# Altium project PprzSDLogger.PrjPcb
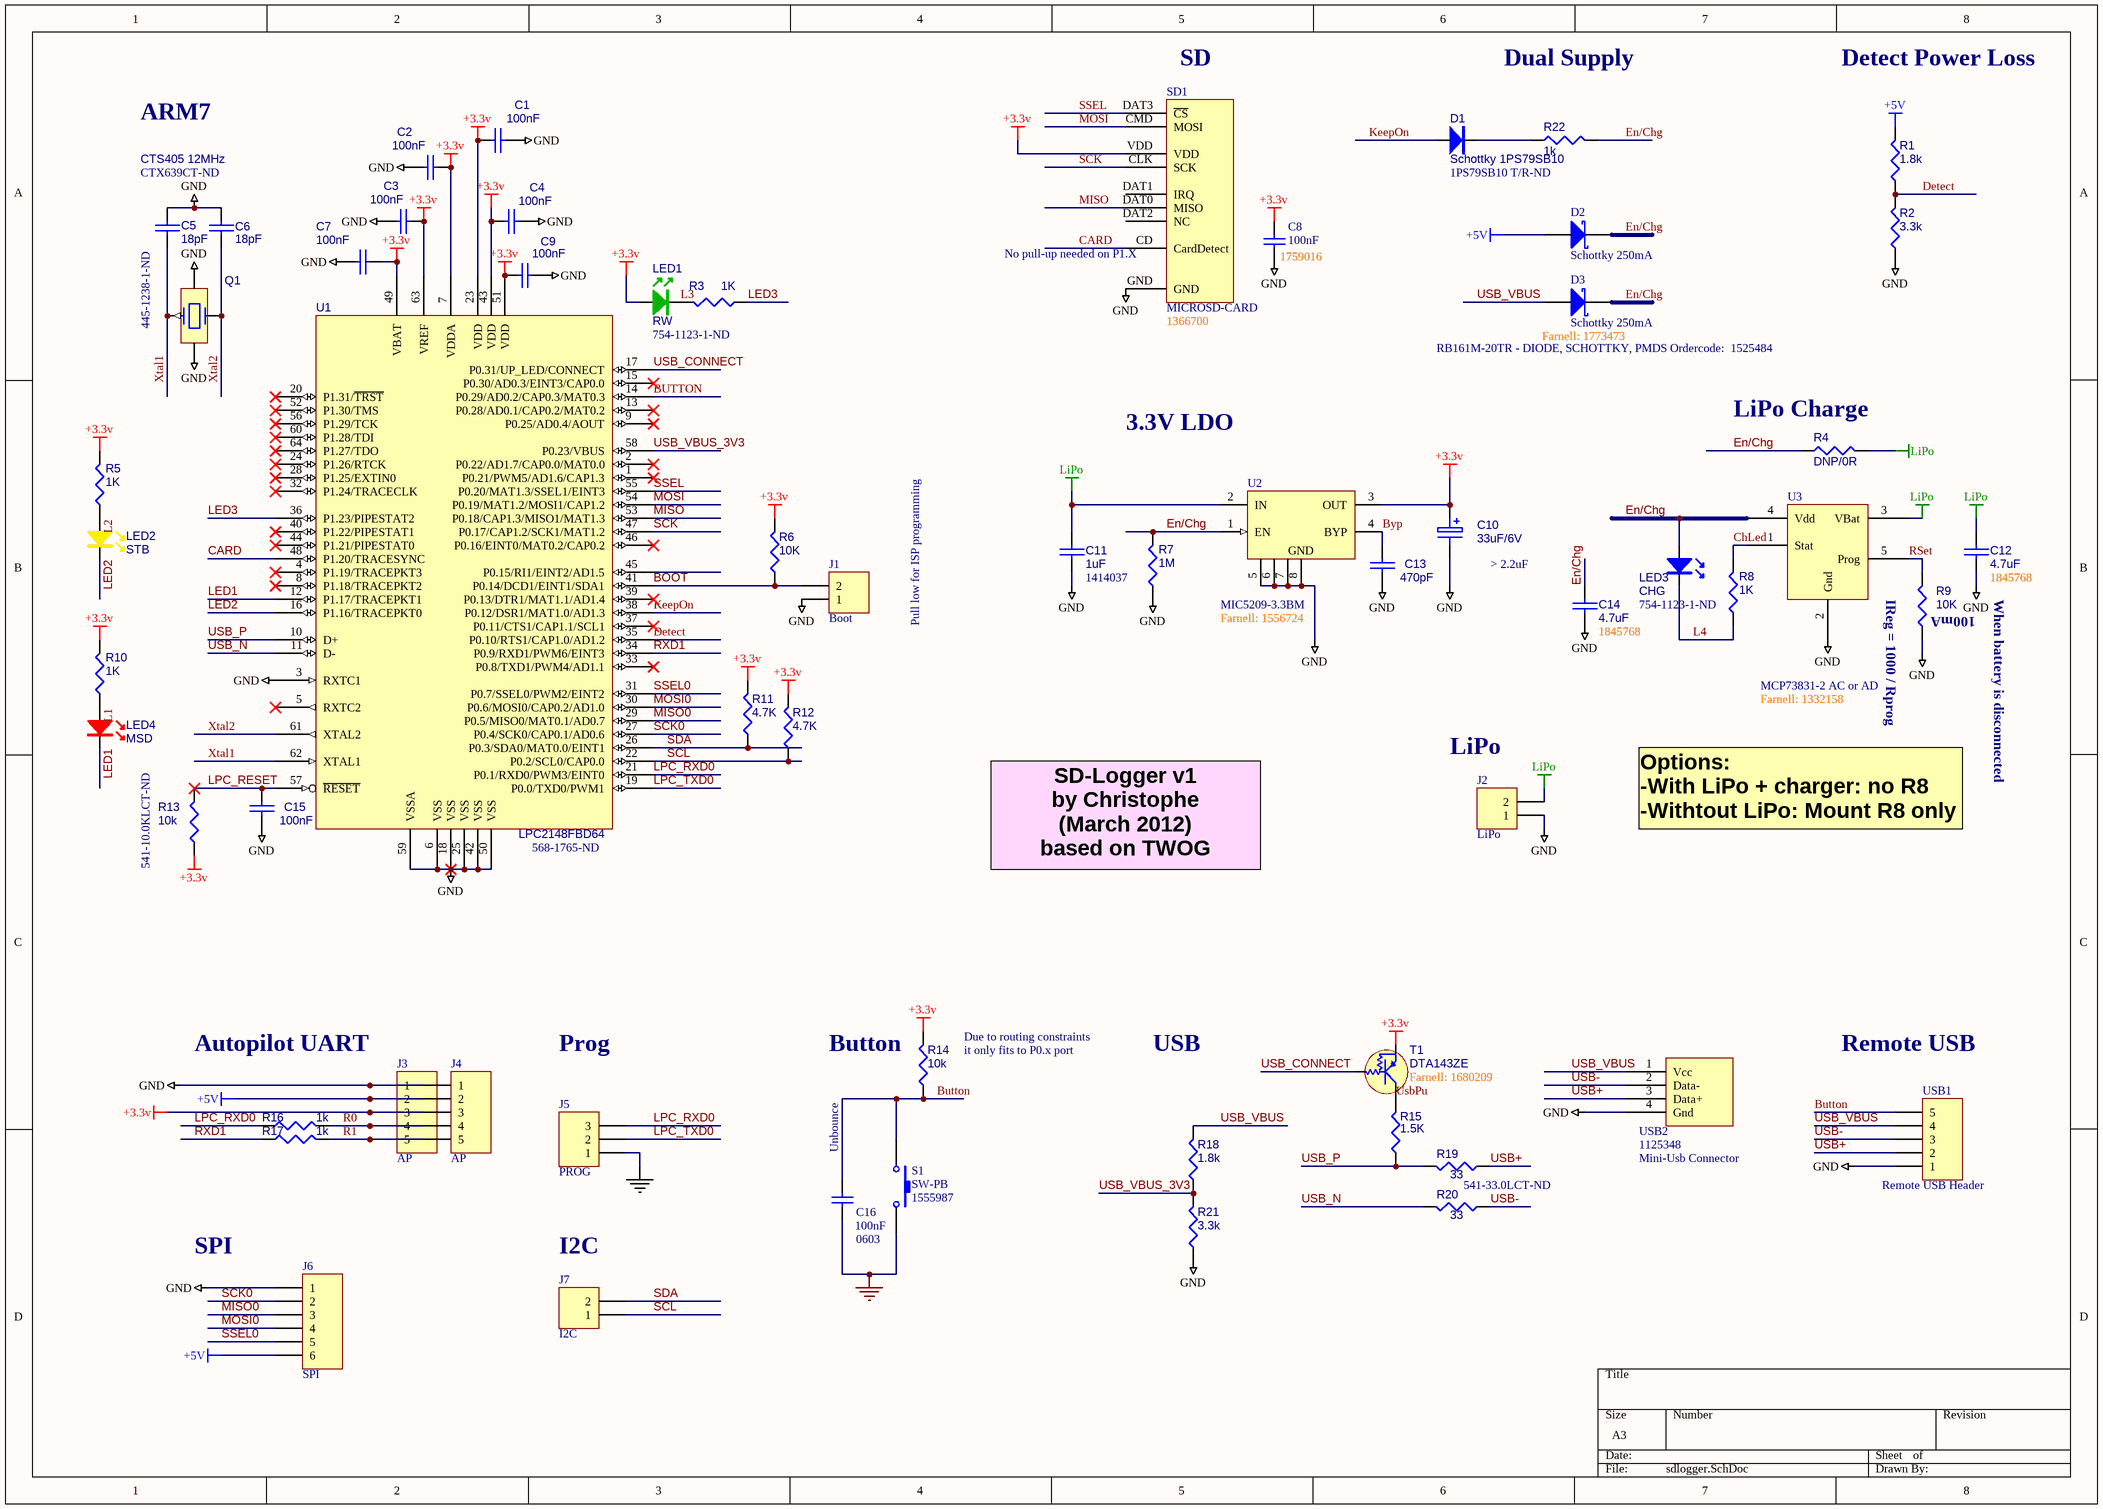
[diagram p0: sdlogger.SchDoc]
1 sheet, 61 parts. Net scope: global (net labels, ports and power ports of the same name join across sheets).
Board file: sdlogger.PcbDoc

## Sheet sdlogger.SchDoc
size A3; PageSetup: Record=PageOptions|CenterHorizontal=True|CenterVertical=True|PrintScale=1.00|XCorrection=1.00|YCorrection=1.00|PrintKind=0|BorderSize=5000000|LeftOffset=0|BottomOffset=0|Orientation=2|PaperLength=1000|PaperWidth=1000|Scale=100|PaperSource=7|PrintQuality=-4|MediaType=1|DitherType=10|PaperKind=A4|PrintScaleMode=1

### Parts
C1  100nF  [0603]
C2  100nF  [0603]
C3  100nF  [0603]
C4  100nF  [0603]
C5  18pF  Supplier Part Number 1: 445-1238-1-ND  [0603]
C6  18pF  [0603]
C7  100nF  [0603]
C8  value 100nF  Farnell: 1759016  [0603]  (hidden comment: 0603)
C9  100nF  [0603]
C10  33uF/6V  [T491A]
C11  1uF  farnell: 1414037  [0805]
C12  4.7uF  farnell: 1845768  [0805]
C13  470pF  [0603]
C14  4.7uF  farnell: 1845768  [0805]
C15  100nF  [0603]
C16  0603  value 100nF  [0603]
D1  Schottky 1PS79SB10  Supplier Part Number 1: 1PS79SB10 T/R-ND  [1PS79SB10]
D2  Schottky 250mA  [SOD123]
D3  Schottky 250mA  Farnell: 1773473  [SOD123]
J1  Boot  [2pin1mmpitch]
J2  LiPo  [PICOBLADE_53047-0210]
J3  AP  [PICOBLADE_53047-0510_FLAT]
J4  AP  [PICOBLADE_53047-0510_FLAT]
J5  PROG  [PICOBLADE_53047-0310]
J6  SPI  [PICOBLADE_53047-0610]
J7  I2C  [PICOBLADE_53047-0210]
LED1  RW  Supplier Part Number 1: 754-1123-1-ND  [KP-1608SURC]
LED2  STB  [KP-1608SURC]
LED3  CHG  Supplier Part Number 1: 754-1123-1-ND  [KP-1608SURC]
LED4  MSD  [KP-1608SURC]
Q1  CTS405 12MHz  Supplier Part Number 1: CTX639CT-ND  [CTS_405]
R1  1.8k  [0603RES]
R2  3.3k  [0603RES]
R3  1K  [0603RES]
R4  DNP/0R  [0603RES]
R5  1K  [0603RES]
R6  10K  [0603RES]
R7  1M  [0603RES]
R8  1K  [0603RES]
R9  10K  [0603RES]
R10  1K  [0603RES]
R11  4.7K  [0603RES]
R12  4.7K  [0603RES]
R13  10k  Supplier Part Number 1: 541-10.0KLCT-ND  [0603RES]
R14  10k  [0603RES]
R15  1.5K  [0603RES]
R16  1k  [0603RES]
R17  1k  [0603RES]
R18  1.8k  [0603RES]
R19  33  Supplier Part Number 1: 541-33.0LCT-ND  [0603RES]
R20  33  [0603RES]
R21  3.3k  [0603RES]
R22  1k  [0603RES]
S1  SW-PB  Farnell: 1555987  [FSMRA2JH]
SD1  MICROSD-CARD  Farnell: 1366700  [MICROSD-card]
T1  DTA143ZE  Farnell: 1680209  [DTA143ZE]
U1  LPC2148FBD64  Supplier Part Number 1: 568-1765-ND  [LPC2148FBD64]
U2  value MIC5209-3.3BM  Farnell: 1556724  [SO8]  (hidden comment: MIC5209-3.3YM)
U3  Farnell: 1332158  [SOT23-5]  (hidden comment: MCP73831-2 AC or AD)
USB1  Remote USB Header  [PICOBLADE_53047-0510_FLAT_ONLY]
USB2  Mini-Usb Connector  Farnell: 1125348  [miniUSB]

### Nets
+3.3v: C1.1 C2.2 C3.2 C4.1 C7.2 C8.1 C9.2 C10.1 J3.3 J4.3 LED1.1(A) R5.2 R6.2 R10.2 R11.2 R12.2 R13.1 R14.2 SD1.VDD T1.2 U1.7(VDDA) U1.23(VDD) U1.43(VDD) U1.49(VBAT) U1.51(VDD) U1.63(VREF) U2.3(OUT)
+5V: D2.1(A) J3.2 J4.2 J6.6 R1.2
GND: C1.2 C2.1 C3.1 C4.2 C5.1 C6.1 C7.1 C8.2 C9.1 C10.2 C11.2 C12.2 C13.2 C14.2 C15.2 C16.1 J1.1 J2.1 J3.1 J4.1 J5.1 J6.1 Q1.2 Q1.4 R2.1 R7.1 R9.1 R21.1 S1.2 SD1.GND U1.3(RXTC1) U1.6(VSS) U1.18(VSS) U1.25(VSS) U1.42(VSS) U1.50(VSS) U1.59(VSSA) U2.5(GND) U2.6(GND) U2.7(GND) U2.8(GND) U3.2(Gnd) USB1.1 USB2.4(Gnd)
LiPo: C11.1 C12.1 J2.2 R4.2 U2.2(IN) U3.3(VBat)
BOOT: J1.2 R6.1 U1.41(P0.14/DCD1/EINT1/SDA1)
Button: C16.2 R14.1 S1.1 U1.14(P0.29/AD0.2/CAP0.3/MAT0.3) USB1.5
Byp: C13.1 U2.4(BYP)
CARD: SD1.CD(CardDetect) U1.48(P1.20/TRACESYNC)
ChLed: R8.2 U3.1(Stat)
Detect: R1.1 R2.2 U1.35(P0.10/RTS1/CAP1.0/AD1.2)
En/Chg: C14.1 D2.2(K) D3.2(K) LED3.1(A) R4.1 R7.2 R22.2 U2.1(EN) U3.4(Vdd)
KeepOn: D1.2(A) U1.38(P0.12/DSR1/MAT1.0/AD1.3)
L1: LED4.1(A) R10.1
L2: LED2.1(A) R5.1
L3: LED1.2(K) R3.2
L4: LED3.2(K) R8.1
LED1: LED4.2(K) U1.12(P1.17/TRACEPKT1)
LED2: LED2.2(K) U1.16(P1.16/TRACEPKT0)
LED3: R3.1 U1.36(P1.23/PIPESTAT2)
LPC_RESET: C15.1 R13.2 U1.57(~{RESET})
LPC_RXD0: J5.3 R16.1 U1.21(P0.1/RXD0/PWM3/EINT0)
LPC_TXD0: J5.2 U1.19(P0.0/TXD0/PWM1)
MISO: SD1.DAT0(MISO) U1.53(P0.18/CAP1.3/MISO1/MAT1.3)
MISO0: J6.3 U1.29(P0.5/MISO0/MAT0.1/AD0.7)
MOSI: SD1.CMD(MOSI) U1.54(P0.19/MAT1.2/MOSI1/CAP1.2)
MOSI0: J6.4 U1.30(P0.6/MOSI0/CAP0.2/AD1.0)
R0: J3.4 J4.4 R16.2
R1: J3.5 J4.5 R17.2
RSet: R9.2 U3.5(Prog)
RXD1: R17.1 U1.34(P0.9/RXD1/PWM6/EINT3)
SCK: SD1.CLK(SCK) U1.47(P0.17/CAP1.2/SCK1/MAT1.2)
SCK0: J6.2 U1.27(P0.4/SCK0/CAP0.1/AD0.6)
SCL: J7.1 R12.1 U1.22(P0.2/SCL0/CAP0.0)
SDA: J7.2 R11.1 U1.26(P0.3/SDA0/MAT0.0/EINT1)
SSEL: SD1.DAT3(~{CS}) U1.55(P0.20/MAT1.3/SSEL1/EINT3)
SSEL0: J6.5 U1.31(P0.7/SSEL0/PWM2/EINT2)
USB+: R19.1 USB1.2 USB2.3(Data+)
USB-: R20.1 USB1.3 USB2.2(Data-)
USB_CONNECT: T1.1 U1.17(P0.31/UP_LED/CONNECT)
USB_N: R20.2 U1.11(D-)
USB_P: R15.1 R19.2 U1.10(D+)
USB_VBUS: D3.1(A) R18.2 USB1.4 USB2.1(Vcc)
USB_VBUS_3V3: R18.1 R21.2 U1.58(P0.23/VBUS)
UsbPu: R15.2 T1.3
Xtal1: C5.2 Q1.1 U1.62(XTAL1)
Xtal2: C6.2 Q1.3 U1.61(XTAL2)
NetD1_1: D1.1(K) R22.1

Not connected (* = marked no-connect by the designer): SD1 DAT1(IRQ) DAT2(NC); U1 1(P0.21/PWM5/AD1.6/CAP1.3)* 2(P0.22/AD1.7/CAP0.0/MAT0.0)* 4(P1.19/TRACEPKT3)* 5(RXTC2)* 8(P1.18/TRACEPKT2)* 9(P0.25/AD0.4/AOUT)* 13(P0.28/AD0.1/CAP0.2/MAT0.2)* 15(P0.30/AD0.3/EINT3/CAP0.0)* 20(P1.31/~{TRST})* 24(P1.26/RTCK)* 28(P1.25/EXTIN0)* 32(P1.24/TRACECLK)* 33(P0.8/TXD1/PWM4/AD1.1)* 37(P0.11/CTS1/CAP1.1/SCL1)* 39(P0.13/DTR1/MAT1.1/AD1.4)* 40(P1.22/PIPESTAT1)* 44(P1.21/PIPESTAT0)* 45(P0.15/RI1/EINT2/AD1.5) 46(P0.16/EINT0/MAT0.2/CAP0.2)* 52(P1.30/TMS)* 56(P1.29/TCK)* 60(P1.28/TDI)* 64(P1.27/TDO)*

### Notes on the sheet
- (near SD1) SD
- Dual Supply
- Detect Power Loss
- ARM7
- (near SD1) No pull-up needed on P1.X
- (near D3) RB161M-20TR - DIODE, SCHOTTKY, PMDS Ordercode:  1525484
- 3.3V LDO
- (near R4) LiPo Charge
- > 2.2uF
- Pull low for ISP programming
- IReg = 1000 / Rprog
- (near R9) 100mA
- When battery is disconnected
- (near J2) LiPo
- Options:
  -With LiPo + charger: no R8
  -Withtout LiPo: Mount R8 only
- SD-Logger v1
  by Christophe
  (March 2012)
  based on TWOG
- (near J3) Autopilot UART
- Prog
- (near R14) Button
- (near R14) Due to routing constraints
- (near R14) it only fits to P0.x port
- USB
- Remote USB
- Unbounce
- SPI
- (near J7) I2C

### Library data of the parts
C1-C7 C9 C11-C15 = CAP
  C5: Supplier 1: Digi-Key
C8 = Cap: Capacitor; ps: 1000; Note: 0603, X7R, 16V, 100NF; Revision: July-2002: Re-released for DXP Platform.; Price: 0.005
C10 = ELECTRO1
C16 = Cap: Capacitor; Published: 8-Jun-2000; Revision: July-2002: Re-released for DXP Platform.; Publisher: Altium Limited
D1 = 1PS79SB10: Diode Schottky 0.2A/30v (GRZ 09/2007); Supplier 1: Digi-Key
D2 D3 = D Schottky: Schottky Diode; Published: 8-Jun-2000; LatestRevisionDate: 17-Jul-2002; LatestRevisionNote: Re-released for DXP Platform.; PackageReference: SMB; Publisher: Altium Limited; Code_JEDEC: DO-214-AA
J1 J2 J7 = Header 2: Header, 2-Pin; LatestRevisionDate: 17-Jul-2002; LatestRevisionNote: Re-released for DXP Platform.; Publisher: Altium Limited
J3 J4 USB1 = Header 5: Header, 5-Pin; LatestRevisionDate: 17-Jul-2002; LatestRevisionNote: Re-released for DXP Platform.; Publisher: Altium Limited
J5 = Header 3: Header, 3-Pin; LatestRevisionDate: 17-Jul-2002; LatestRevisionNote: Re-released for DXP Platform.; Publisher: Altium Limited
J6 = Header 6: Header, 6-Pin; LatestRevisionDate: 17-Jul-2002; LatestRevisionNote: Re-released for DXP Platform.; Publisher: Altium Limited
LED1 = KP-1608SURC: Led vert 0603; Supplier 1: Digi-Key
LED2 = KP-1608SURC_1: Led jaune 0603; Supplier 1: Digi-Key
LED3 LED4 = KP-1608SURC: Led rouge 0603 (GRZ 10/2007); Supplier 1: Digi-Key
Q1 = CRYSTAL_CTS_405: Crystal 12 Mhz SMD (DMT 06/2007); Text Field1: CTS-Frequency Controls; Text Field2: 405C 35B 12M0000; Text Field3: Digikey; Text Field4: CTX639CT-ND; Supplier 1: Digi-Key
R1-R22 = RES1
  R1 R2 R13 R16-R19 R21: Supplier 1: Digi-Key
S1 = SW-PB: Switch; Published: 24-Mar-1999; LatestRevisionDate: 17-Jul-2002; LatestRevisionNote: Re-released for DXP Platform.; PackageReference: SPST-2; Publisher: Altium Limited
SD1 = MICROSD-CARD: ps: 50; Value: MOLEX - 49225-0821; Note: MICRO SD; Price: 2.06
T1 = DTA143ZE: PNP PRE-BIASED SMALL SIGNAL SURFACE MOUNT TRANSISTOR (GRZ 09/2009)
U1 = LPC2148FBD64: Single-chip ARM7 32-bit microcontroller (GRZ 04/2007); Supplier 1: Digi-Key
U2 = MIC5209-3.3YM: Micropower 100 mA Ultra Low-Dropout Regulator in SOT-23 and micro SMD Packages; Revision: Jan-2010
U3 = MCP73831-2Ax: Lithium Battery Charger max 500mA: 7.5% I/Ireg stop, 10% Iprecon ...; value: MCP73831-2 AC or AD
USB2 = USB_Host: Mini USB Connector; pin to pad: 1>VBus 2>D- 3>D+ 4>GND